# EAGLE design Scrapyard_555 (EAGLE 5.11)
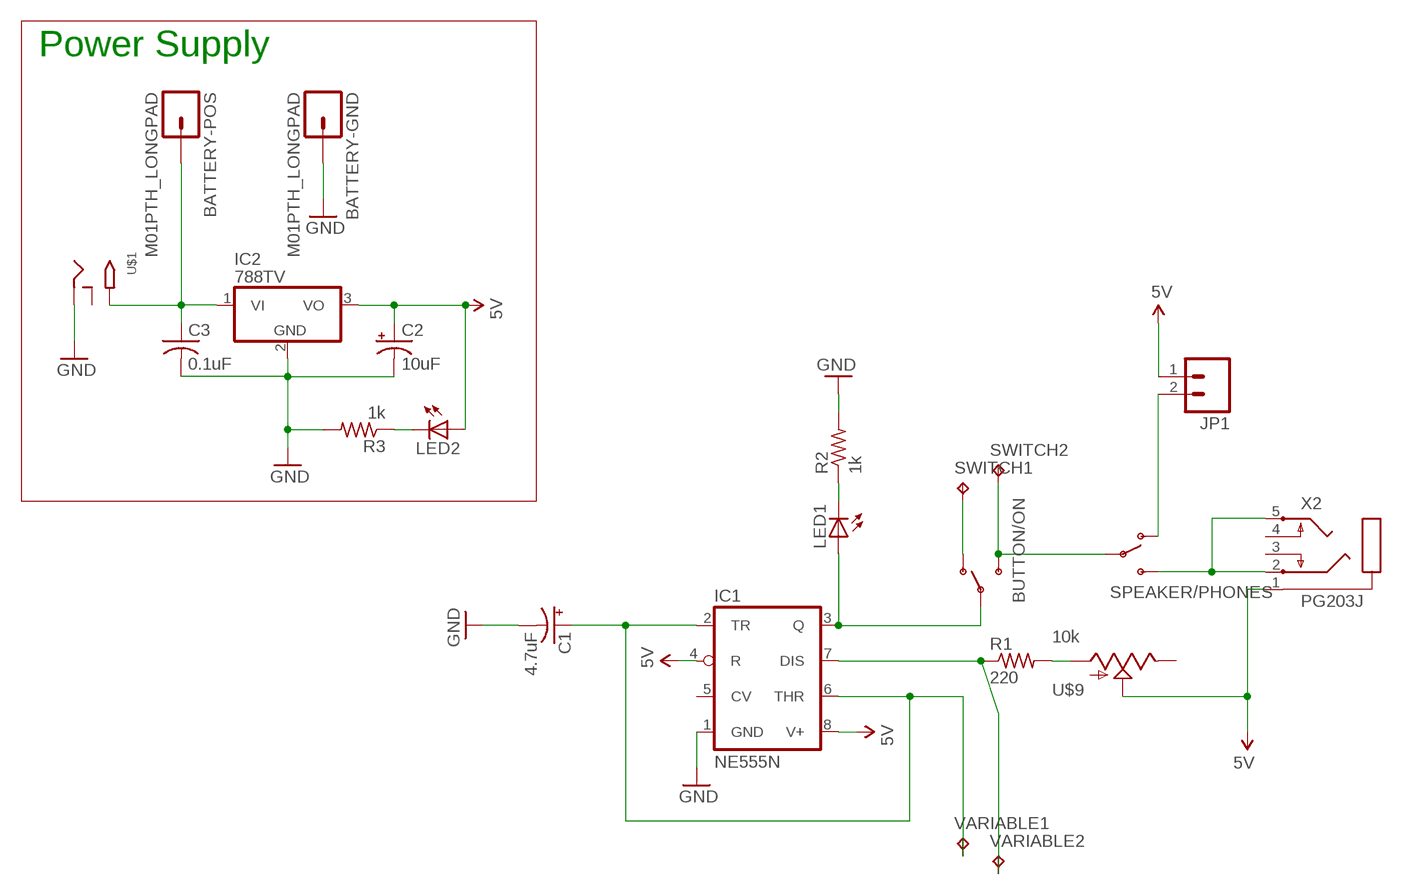
[diagram p0: schematic, sheet 1]

## Parts
BATTERY-GND  M01PTH_LONGPAD  [1X01_LONGPAD]
BATTERY-POS  M01PTH_LONGPAD  [1X01_LONGPAD]
BUTTON/ON  SWITCH-SPSTKIT  [SWITCH-SPDT_KIT]
C1  4.7uF  CPOL-USE2.5-6  [E2,5-6]
C2  10uF  CPOL-USE2.5-6  [E2,5-6]
C3  0.1uF  C-US025-030X050  [C025-030X050]
IC1  NE555N  [DIL08-ROUND]
IC2  788TV  [TO220V]
JP1  M023.5MM_LOCK  [SCREWTERMINAL-3.5MM-2_LOCK]
LED1  LED5MM  [LED5MM]
LED2  LED5MM  [LED5MM]
R1  220  R-US_0204/7  [0204/7]
R2  1k  R-US_0204/7  [0204/7]
R3  1k  R-US_0204/7  [0204/7]
SPEAKER/PHONES  SWITCH-SPSTKIT  [SWITCH-SPDT_KIT]
SWITCH1  TPPAD1-20Y  [P1-20Y]
SWITCH2  TPPAD1-20Y  [P1-20Y]
U$1  2.1MMJACKTHM  [PJ-102A]
U$9  10k  POT  [ALPS_POT]
VARIABLE1  TPPAD1-20Y  [P1-20Y]
VARIABLE2  TPPAD1-20Y  [P1-20Y]
X2  PG203J  [PG203J]

## Nets
5V: C2.+ IC1.4(R) IC1.8(V+) IC2.3(VO) JP1.1 LED2.A U$9.P$2(S) X2.1
GND: BATTERY-GND.1 C1.- C2.- C3.2 IC1.1(GND) IC2.2(GND) R2.2 R3.2 U$1.RING
N$1: C1.+ IC1.2(TR) IC1.6(THR) VARIABLE1.TP
N$2: BATTERY-POS.1 C3.1 IC2.1(VI) U$1.TIP
N$3: BUTTON/ON.2(P) IC1.3(Q) LED1.A
N$4: LED1.K(C) R2.1
N$5: IC1.7(DIS) R1.1 VARIABLE2.TP
N$6: JP1.2 SPEAKER/PHONES.1(O)
N$7: SPEAKER/PHONES.3(S) X2.2 X2.5
N$8: BUTTON/ON.3(S) SPEAKER/PHONES.2(P) SWITCH2.TP
N$9: BUTTON/ON.1(O) SWITCH1.TP
N$10: R1.2 U$9.P$3(A)
N$13: LED2.K(C) R3.1
Unconnected: IC1.5(CV) U$1.RING_SW U$9.P$1(E) X2.3 X2.4

## Notes on the sheet
- Power Supply

## Library data of the parts
BATTERY-GND BATTERY-POS = SparkFun:M01: Header 1 Standard 1-pin 0.1" header. Use with straight break away headers (SKU : PRT-00116), right angle break away headers (PRT-00553), swiss pins (PRT-00743), machine pins (PRT-00117), and female headers (PRT-00115).
BUTTON/ON SPEAKER/PHONES = SparkFun:SWITCH-SPST: SPST Switch Simple slide switch. Spark Fun Electronics SKU : COM-00102
C1 C2 = resistor:CPOL-US: POLARIZED CAPACITOR, American symbol
C3 = adafruit:C-US: CAPACITOR, American symbol
IC1 = adafruit:*555: TIMER Changed DIP package to have round (not oval) pin pads http://www.ladyada.net/library/pcb/eaglelibrary.html
IC2 = linear:78*: Positive VOLTAGE REGULATOR Source: http://cache.national.com/ds/LM/LM78L05.pdf http://www.fairchildsemi.com/ds/LM/LM7805.pdf
JP1 = SparkFun:M02: Header 2 Standard 2-pin 0.1" header. Use with straight break away headers (SKU : PRT-00116), right angle break away headers (PRT-00553), swiss pins (PRT-00743), machine pins (PRT-00117), and female headers (PRT-00115). Molex polarized connector foot print use with SKU : PRT-08233 with associated crimp pins and housings.
LED1 LED2 = adafruit:LED: LED OSRAM: - CHIPLED LG R971, LG N971, LY N971, LG Q971, LY Q971, LO R971, LY R971 LH N974, LH R974 LS Q976, LO Q976, LY Q976 LO Q996 - Hyper CHIPLED LW Q18S LB Q993, LB Q99A, LB R99A - SideLED LS A670, LO A670, LY A670, LG A670, LP A670 LB A673, LV A673, LT A673, LW A673 LH A674 LY A675 LS A676, LA A676, LO A676, LY A676, LW A676 LS A679, LY A679, LG A679 - Hyper Micro SIDELED® LS Y876, LA Y876, LO Y876, LY Y876 LT Y87S - SmartLED LW L88C, LW L88S LB L89C, LB L89S, LG L890 LS L89K, LO L89K, LY L89K LS L896, LA L896, LO L896, LY L896 - TOPLED LS T670, LO T670, LY T670, LG T670, LP T670 LSG T670, LSP T670, LSY T670, LOP T670, LYG T670 LG T671, LOG T671, LSG T671 LB T673, LV T673, LT T673, LW T673 LH T674 LS T676, LA T676, LO T676, LY T676, LB T676, LH T676, LSB T676, LW T676 LB T67C, LV T67C, LT T67C, LS T67K, LO T67K, LY T67K, LW E67C LS E67B, LA E67B, LO E67B, LY E67B, LB E67C, LV E67C, LT E67C LW T67C LS T679, LY T679, LG T679 LS T770, LO T770, LY T770, LG T770, LP T770 LB T773, LV T773, LT T773, LW T773 LH T774 LS E675, LA E675, LY E675, LS T675 LS T776, LA T776, LO T776, LY T776, LB T776 LHGB T686 LT T68C, LB T68C - Hyper Mini TOPLED® LB M676 - Mini TOPLED Santana® LG M470 LS M47K, LO M47K, LY M47K Source: http://www.osram.convergy.de/
R1-R3 = adafruit:R-US_: RESISTOR, American symbol
SWITCH1 SWITCH2 VARIABLE1 VARIABLE2 = testpad:TP: Test pad
U$1 = adafruit:2.1MMJACK: 2.1mm x 5.5mm THM DC jack with internal switch. Digikey part #PJ-102A, 4UCON part #05537 2.1mm x 5.5mm SMT DC jack with internal switch. Digikey part #PJ-002A-SMT, 4UCON part #03267 By microbuilder.eu & adafruit.com
U$9 = SparkFun:POT
X2 = con-hirschmann:PG203J: MIC/HEADPHONE JACK KS-S stereo microphone/headphone jack PG203JN (Schukat); OC_FARNELL: unknown; OC_NEWARK: unknown

## Board
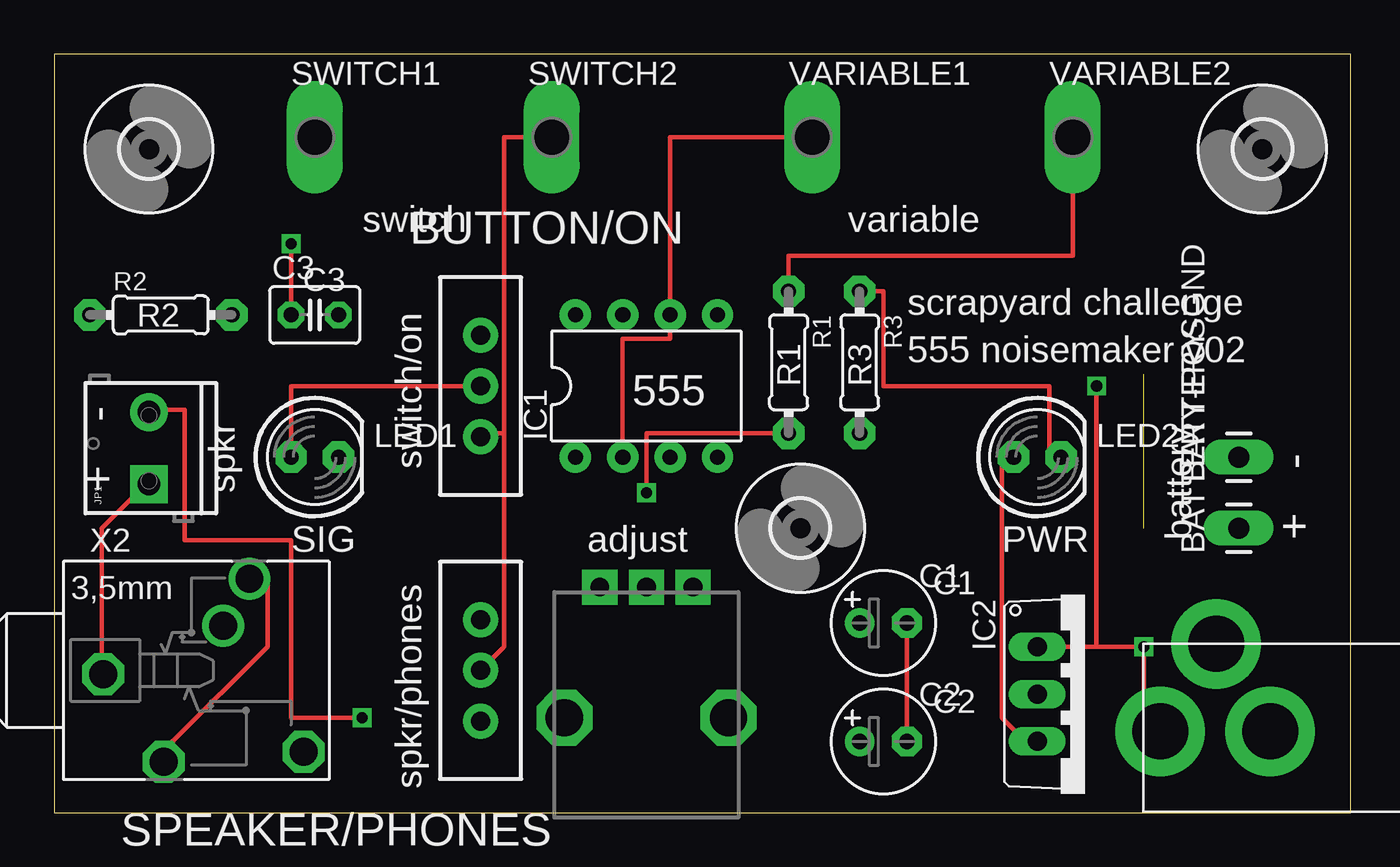
[diagram p1: board, top side]
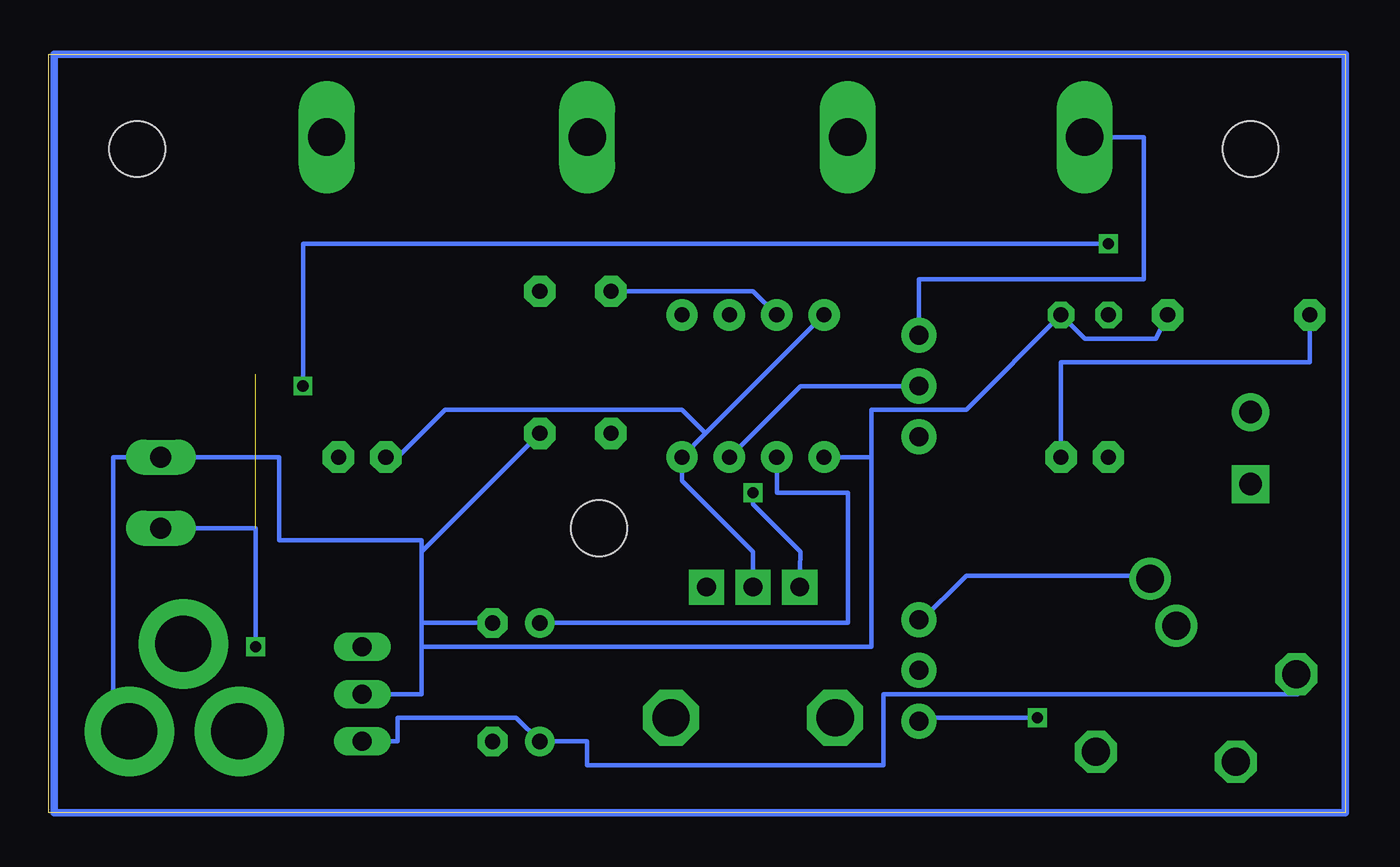
[diagram p2: board, bottom side, seen from below]

Size 69.52 x 40.63 mm. Coordinates in mm from the lower left corner, seen from the top.
Outline: 0,0 69.52,0 69.52,40.63 0,40.63 0,0
Copper layers (1*16): Top 0.035mm / dielectric 1.5mm / Bottom 0.035mm
Design rules: minimum track width 10mil, minimum drill 24mil, track to track 8mil, track to pad 8mil, pad to pad 8mil, via to via 8mil, smd to smd 8mil, copper to edge 40mil, drill to drill 8mil, minimum pad ring 10mil, minimum via ring 8mil, stop-mask expansion 4mil, vias tented up to drill 0mil, thermal gap 10mil

### Footprints (pad centres in the part's own frame; a part is rotated, then mirrored left to right if it is on the bottom)
1X01_LONGPAD = drill 1.118 pad 1.88 long: 1 0,0
SWITCH-SPDT_KIT = drill 1.016 pad 1.88: 1 0,2.718; 2 0,0; 3 0,-2.718
E2,5-6 = drill 0.813 pad 1.6: + -1.27,0 | drill 0.813 pad 1.6 octagon: - 1.27,0
C025-030X050 = drill 0.813 pad 1.422 octagon: 1 -1.27,0; 2 1.27,0
DIL08-ROUND = drill 0.813 pad 1.676: 1 -3.81,-3.81; 2 -1.27,-3.81; 3 1.27,-3.81; 4 3.81,-3.81; 5 3.81,3.81; 6 1.27,3.81; 7 -1.27,3.81; 8 -3.81,3.81
TO220V = drill 1.016 long: 1 -2.54,-2.54; 2 0,-2.54; 3 2.54,-2.54
SCREWTERMINAL-3.5MM-2_LOCK = drill 1.2 pad 2.032 square: 1 -0.178,0 | drill 1.2 pad 2.032: 2 3.678,0
LED5MM = drill 0.813 pad 1.676 octagon: A -1.27,0; K 1.27,0
0204/7 = drill 0.813 pad 1.676 octagon: 1 -3.81,0; 2 3.81,0
P1-20Y = drill 2.007 pad 2.54 long: TP 0,0
PJ-102A = drill 3 pad 4.8: RING 0.1,-3.39; RING_SW -4.6,-6.29; TIP 0.1,-9.29
3,0 = hole 3: 0,0
ALPS_POT = drill 1 pad 1.88 square: P$1 7,-2.5; P$2 7,0; P$3 7,2.5 | drill 2 octagon: P$4 0,-4.4; P$5 0,4.4
PG203J = drill 1.499 octagon: 1 -5.004,-0.203; 4 5.74,-4.369; 5 -1.753,-4.902 | drill 1.499: 2 2.845,4.902; 3 1.448,2.388

### Placement (x,y rotation side)
BATTERY-GND  63.5,19.05 90 top
BATTERY-POS  63.5,15.24 90 top
BUTTON/ON  22.86,22.86 0 top
C1  44.45,10.16 0 top
C2  44.45,3.81 0 top
C3  13.97,26.67 0 top
IC1  31.75,22.86 0 top
IC2  55.24,6.35 270 top
JP1  5.08,17.78 90 top
LED1  13.97,19.05 0 top
LED2  52.7,19.05 0 top
R1  39.37,24.13 270 top
R2  5.71,26.67 0 top
R3  43.18,24.13 270 top
SPEAKER/PHONES  22.86,7.62 180 top
SWITCH1  13.97,36.2 0 top
SWITCH2  26.67,36.2 0 top
U$1  68.58,4.45 270 top
U$5  [3,0]  40.01,15.24 0 top
U$6  [3,0]  64.77,35.56 0 top
U$9  31.75,5.08 90 top
U$10  [3,0]  5.08,35.56 0 top
VARIABLE1  40.64,36.2 0 top
VARIABLE2  54.61,36.2 0 top
X2  7.62,7.62 0 top

### Tracks (layer width: path | path; a pad name or v marks a point on that pad's centre or on a via)
5V
  Top 0.254: JP1.1 5.08,17.78 2.54,15.24 2.54,7.62 X2.1 | LED2.A 50.8,19.05 50.8,5.08 52.07,3.81 IC2.3
  Bottom 0.254: IC2.3 50.8,3.81 50.8,5.08 44.45,5.08 C2.+ 40.64,3.81 40.64,2.54 25.4,2.54 24.77,2.54 24.77,6.35 2.54,6.35 X2.1 | JP1.1 5.08,17.78 | LED2.A 50.8,19.05 48.26,21.59 35.56,21.59 34.29,20.32 | 34.29,20.32 IC1.4 35.56,17.78 31.75,13.97 U$9.P$2 | 34.29,20.32 IC1.8
GND
  Top 0.254: C1.- C2.-
  Bottom 0.254: R2.2 10.16,25.4 13.97,25.4 C3.2 20.32,21.59 25.4,21.59 25.4,19.05 | 49.53,8.89 49.53,10.16 | 49.53,8.89 49.53,6.35 IC2.2 | 49.53,10.16 C1.- | U$1.RING 66.04,5.08 66.04,19.05 BATTERY-GND.1 57.15,19.05 57.15,14.61 49.53,14.61 49.53,13.97 | 49.53,10.16 49.53,13.97 | 49.53,13.97 R3.2 | 25.4,19.05 IC1.1 | 25.4,19.05 25.4,8.89 49.53,8.89
N$1
  Top 0.254: IC1.2 30.48,25.4 33.02,25.4 IC1.6 33.02,36.2 VARIABLE1.TP
  Bottom 0.254: C1.+ 26.67,10.16 26.67,17.14 30.48,17.14 IC1.2
N$2  (via drill 0.6)  (1 unrouted)
  Top 0.254: C3.1 v12.7,30.48 | U$1.TIP 58.42,5.08 v58.42,8.89 55.88,8.89 | 55.88,8.89 IC2.1 | v55.88,22.86 55.88,8.89
  Bottom 0.254: v58.42,8.89 58.42,15.24 BATTERY-POS.1 | v12.7,30.48 55.88,30.48 v55.88,22.86
N$3
  Top 0.254: LED1.A 12.7,22.86 BUTTON/ON.2
  Bottom 0.254: IC1.3 29.21,22.86 BUTTON/ON.2
N$4
  Bottom 0.254: R2.1 1.91,24.13 15.24,24.13 LED1.K
N$5
  Top 0.254: VARIABLE2.TP 54.61,29.84 39.37,29.84 R1.1
  Bottom 0.254: IC1.7 31.75,27.94 R1.1
N$6  (via drill 0.6)
  Top 0.254: JP1.2 5.08,21.59 6.99,21.59 6.99,14.61 12.7,14.61 12.7,5.08 v16.51,5.08
  Bottom 0.254: v16.51,5.08 22.86,5.08 SPEAKER/PHONES.1
N$7
  Top 0.254: X2.5 6.35,3.81 11.43,8.89 11.43,12.7 X2.2
  Bottom 0.254: X2.2 11.43,12.7 20.32,12.7 22.86,10.16 SPEAKER/PHONES.3
N$8
  Top 0.254: SWITCH2.TP 24.13,36.2 24.13,20.32 | SPEAKER/PHONES.2 24.13,8.89 24.13,20.32 | 24.13,20.32 22.86,20.32 BUTTON/ON.3
N$9
  Bottom 0.254: SWITCH1.TP 10.79,36.2 10.79,28.57 22.86,28.57 BUTTON/ON.1 22.86,25.4
N$10  (via drill 0.6)
  Top 0.254: R1.2 31.75,20.32 v31.75,17.14
  Bottom 0.254: v31.75,17.14 31.75,16.51 29.21,13.97 U$9.P$3
N$11
  Bottom 0.406: 0,0 0,40.64 69.22,40.64 69.22,0 0,0
N$13
  Top 0.254: R3.1 44.45,27.94 44.45,22.86 53.34,22.86 53.34,19.05 LED2.K

### Text on the board
_tsilk: switch | variable | C3 | scrapyard challenge | R2 | 555 noisemaker v02 | 555 | R1 | R3 | - | spkr | switch/on | - | + | battery | + | SIG | adjust | PWR | C1 | C2 | spkr/phones